# EAGLE design HeaterInterface (EAGLE 6.2)
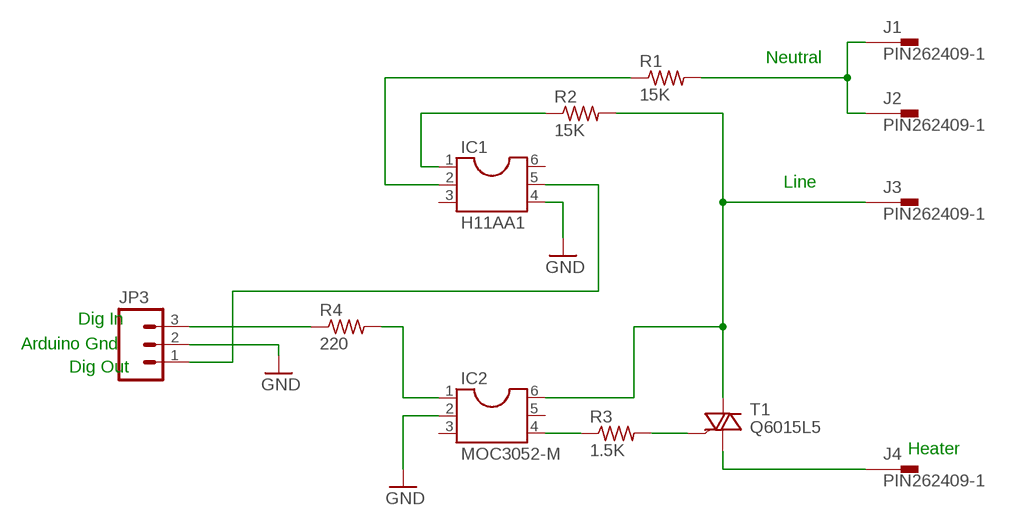
[diagram p0: schematic, sheet 1]

## Parts
IC1  H11AA1  DIL6  [DIL06]
IC2  MOC3052-M  DIL6  [DIL06]
J1  PIN262409-1  [62409-1]
J2  PIN262409-1  [62409-1]
J3  PIN262409-1  [62409-1]
J4  PIN262409-1  [62409-1]
JP3  M03PTH  [1X03]
R1  15K  R-US_0207/10  [0207/10]
R2  15K  R-US_0207/10  [0207/10]
R3  1.5K  R-US_0207/10  [0207/10]
R4  220  R-US_0207/10  [0207/10]
T1  Q6015L5  BT138-H  [TO220BH]

## Nets
GND: IC1.4 IC2.2 JP3.2
N$1: IC1.5 JP3.1
N$2: IC1.2 R1.1
N$3: IC1.1 R2.1
N$5: IC2.6 J3.A1 R2.2 T1.T2(A2)
N$6: JP3.3 R4.1
N$7: IC2.1 R4.2
N$9: IC2.4 R3.1
N$10: R3.2 T1.G
N$11: J4.A1 T1.T1(A1)
NEUTRAL: J1.A1 J2.A1 R1.2
Unconnected: IC1.3 IC1.6 IC2.3 IC2.5 J1.A2(1.1) J2.A2(1.1) J3.A2(1.1) J4.A2(1.1)

## Notes on the sheet
- Neutral
- Line
- Dig In
- Arduino Gnd
- Dig Out
- Heater

## Library data of the parts
IC1 IC2 = ic-package:DIL6: Dual In Line / Socket
J1-J4 = con-faston:PIN2: Flachstecker Typ Tyco/Electronics/AMP TAB, FASTON Printed Circuit Board Tabs Source: http://www.buerklin.com, http://catalog.tycoelectronics.com; OC_FARNELL: unknown; OC_NEWARK: unknown
JP3 = SparkFun:M03: Header 3 Standard 3-pin 0.1" header. Use with straight break away headers (SKU : PRT-00116), right angle break away headers (PRT-00553), swiss pins (PRT-00743), machine pins (PRT-00117), and female headers (PRT-00115). Molex polarized connector foot print use with SKU : PRT-08232 with associated crimp pins and housings.
R1-R4 = rcl:R-US_: RESISTOR, American symbol
T1 = triac:BT138: TRIAC Source: http://www.semiconductors.philips.com BT138_SERIES_2.pdf

## Board
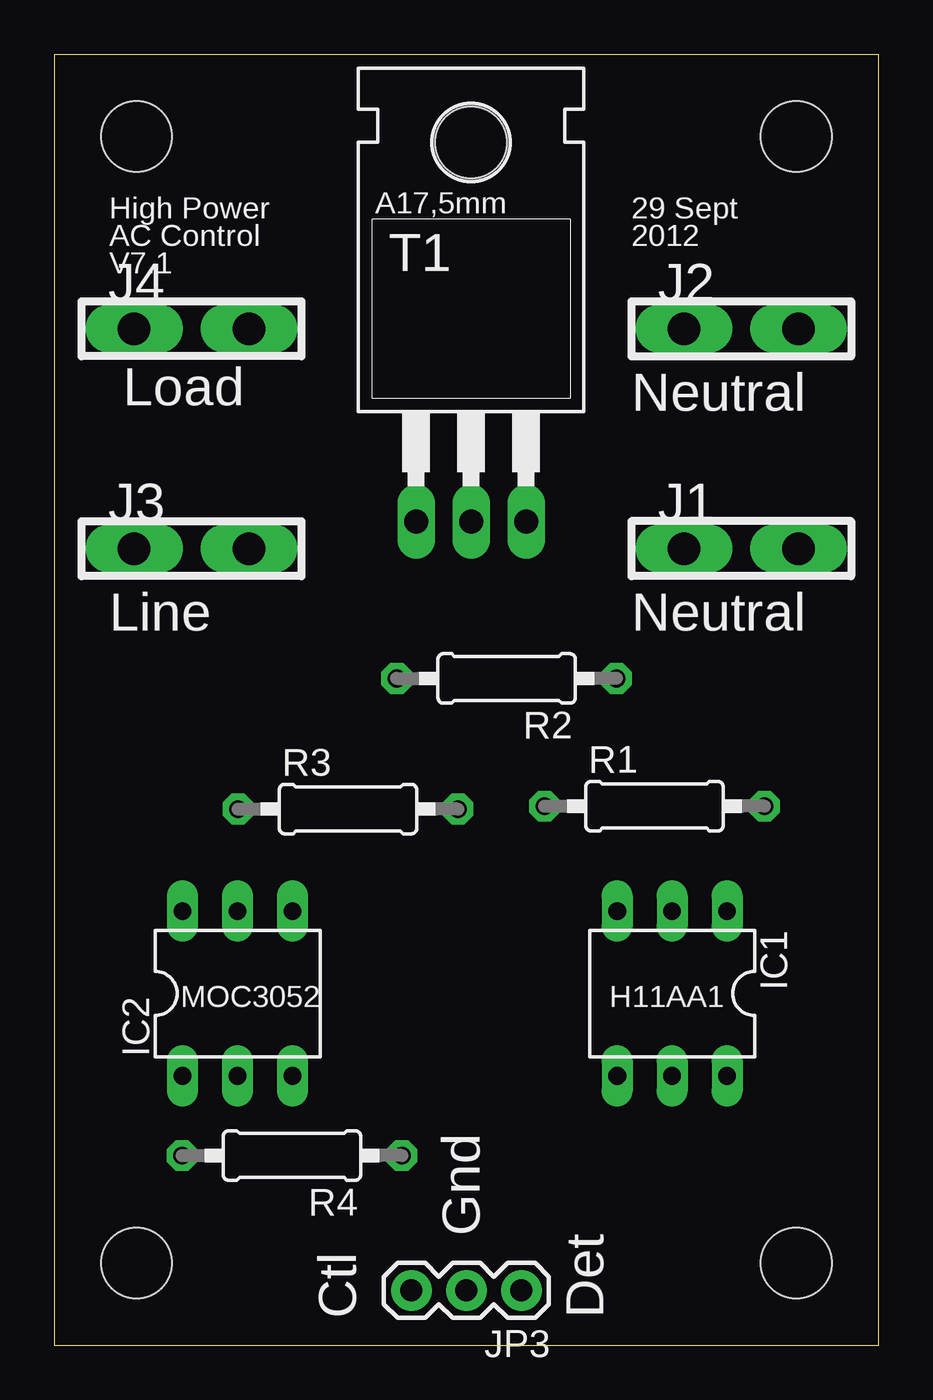
[diagram p1: board, top side]
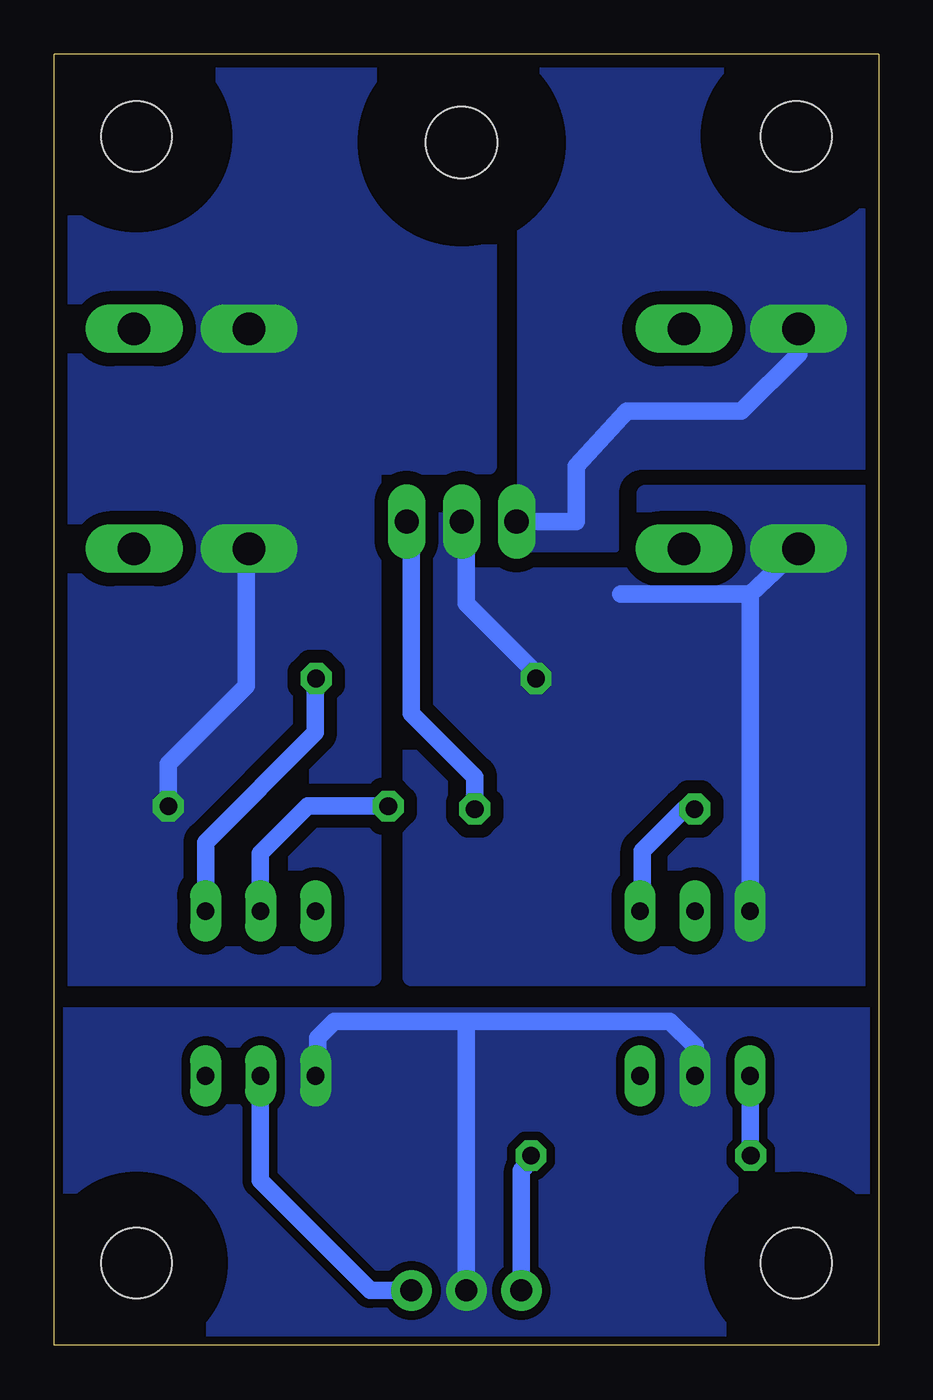
[diagram p2: board, bottom side, seen from below]

Size 38.1 x 59.69 mm. Coordinates in mm from the lower left corner, seen from the top.
Outline: 0,0 38.1,0 38.1,59.69 0,59.69 0,0
Copper layers (1*16): Top 0.035mm / dielectric 1.5mm / Bottom 0.035mm
Design rules: minimum track width 8mil, minimum drill 20mil, track to track 8mil, track to pad 8mil, pad to pad 8mil, via to via 8mil, smd to smd 8mil, copper to edge 10mil, drill to drill 8mil, minimum pad ring 12mil, minimum via ring 10mil, stop-mask expansion 4mil, vias tented up to drill 25mil, thermal gap 10mil
Holes 3.26 mm at 34.29,3.81 3.81,3.81 3.81,55.88 34.29,55.88
bRestrict: area 0,52.1 to 7.6,59.7; area 30.5,52.1 to 38.1,59.7; area 30.5,0 to 38.1,7.6; area 0,0 to 7.6,7.6

### Footprints (pad centres in the part's own frame; a part is rotated, then mirrored left to right if it is on the bottom)
DIL06 = drill 0.813 long: 1 -2.54,-3.81; 2 0,-3.81; 3 2.54,-3.81; 4 2.54,3.81; 5 0,3.81; 6 -2.54,3.81
62409-1 = drill 1.5 pad 1.9 long: A1 -2.65,0; A2 2.65,0
1X03 = drill 1.016 pad 1.88: 1 0,0; 2 2.54,0; 3 5.08,0
0207/10 = drill 0.813 octagon: 1 -5.08,0; 2 5.08,0
TO220BH = drill 1.118 long: G 2.54,-6.35; T1 -2.54,-6.35; T2 0,-6.35 | hole 3.302: 0,11.176

### Placement (x,y rotation side)
IC1  28.56,16.27 180 top
IC2  8.48,16.27 0 top
J1  31.75,36.83 0 top
J2  31.75,46.99 0 top
J3  6.35,36.83 0 top
J4  6.35,46.99 0 top
JP3  21.59,2.54 180 top
R1  27.74,24.93 0 top
R2  20.91,30.83 180 top
R3  13.58,24.79 0 top
R4  10.99,8.78 180 top
T1  19.27,44.43 0 top

### Tracks (layer width: path | path; a pad name or v marks a point on that pad's centre or on a via)
GND
  Bottom 0.813: IC2.2 8.48,13.81 9.65,14.99 18.8,14.99 | 18.8,14.99 25.15,14.99 25.91,14.22 25.91,12.57 IC1.4 | JP3.2 19.05,14.73 18.8,14.99
  pour Bottom (isolate 0.406, no thermals): 0,15.24 38.1,15.24 38.1,0 0,0
N$1
  Bottom 0.813: JP3.1 23.5,2.54 28.57,7.62 28.57,12.45 IC1.5
N$2
  Bottom 0.254: 28.57,20.09 IC1.2
  Bottom 0.813: R1.1 26.38,24.93 28.57,22.73 28.57,20.09
N$3
  Bottom 0.254: 26.04,30.79 R2.1
  Bottom 0.813: IC1.1 31.1,23.26 26.04,28.32 26.04,30.79
N$5
  Bottom 0.813: IC2.6 5.94,34.74 | 5.94,34.74 J3.A1 | 5.94,34.74 11.92,34.74 | 15.8,30.86 15.8,31.04 19.05,34.29 19.05,37.86 T1.T2
  pour Bottom (isolate 0.61, no thermals): 0,39.37 10.79,39.37 10.79,35.56 19.05,35.56 19.05,38.1 21.59,38.1 21.59,17.02 0,17.02
N$6
  Bottom 0.813: 16.35,8.24 R4.1 16.51,8.08 JP3.3
N$7
  Top 0.308: R4.2 5.94,8.56
  Bottom 0.308: R4.2 5.94,8.56
  Bottom 0.813: 5.94,8.56 IC2.1
N$9
  Bottom 0.254: IC2.4 10.92,20.18
  Bottom 0.813: R3.1 8.99,24.79 10.92,22.86 10.92,20.18
N$10
  Bottom 0.813: R3.2 18.66,26.28 21.59,29.21 21.59,37.86 T1.G
N$11
  Bottom 0.813: J4.A1 3.7,45.83 6.35,43.18 11.63,43.18 13.97,40.64 13.97,38.08 T1.T1
  pour Bottom (isolate 0.61, no thermals): 0,40.64 10.92,40.65 arc-90 12.19,39.38 12.19,36.83 16.51,36.83 16.51,59.69 0,59.69
NEUTRAL
  Bottom 0.813: R1.2 32.82,26.87 29.21,30.48 29.21,36.79 J1.A1
  pour Bottom (isolate 0.61, no thermals): 38.1,17.02 38.1,59.69 17.78,59.69 18.03,52.07 18.03,40.64 23.37,40.64 23.37,17.02

### Text on the board
tPlace: High Power | 29 Sept | AC Control | 2012 | V7.1 | Load | Neutral | Line | Neutral | MOC3052 | H11AA1 | Gnd | Ctl | Det